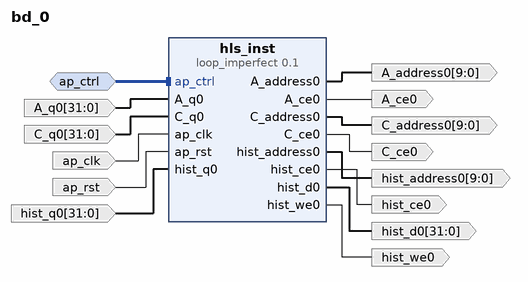
[diagram p0: block diagram of the top level]
# Vivado block design bd_0, xc7k160tfbg484-1, Vivado 2019.2
create_bd_design bd_0

create_bd_intf_port -mode Slave -vlnv xilinx.com:interface:acc_handshake_rtl:1.0 ap_ctrl
create_bd_port -dir O -from 9 -to 0 -type data A_address0
create_bd_port -dir O A_ce0
create_bd_port -dir I -from 31 -to 0 -type data A_q0
create_bd_port -dir O -from 9 -to 0 -type data C_address0
create_bd_port -dir O C_ce0
create_bd_port -dir I -from 31 -to 0 -type data C_q0
create_bd_port -dir I -type clk ap_clk
set_property -dict {CONFIG.FREQ_HZ 250000000.0} [get_bd_ports ap_clk]
create_bd_port -dir I -type rst ap_rst
set_property -dict {CONFIG.POLARITY ACTIVE_HIGH} [get_bd_ports ap_rst]
create_bd_port -dir O -from 9 -to 0 -type data hist_address0
create_bd_port -dir O hist_ce0
create_bd_port -dir O -from 31 -to 0 -type data hist_d0
create_bd_port -dir I -from 31 -to 0 -type data hist_q0
create_bd_port -dir O hist_we0

create_bd_cell -type ip -vlnv xilinx.com:hls:loop_imperfect:0.1 hls_inst

# ---- connections ----

connect_bd_intf_net -intf_net ap_ctrl_0_1 [get_bd_intf_ports ap_ctrl] [get_bd_intf_pins hls_inst/ap_ctrl]
connect_bd_net [get_bd_pins hls_inst/A_address0] [get_bd_ports A_address0]
connect_bd_net [get_bd_pins hls_inst/A_ce0] [get_bd_ports A_ce0]
connect_bd_net -net A_q0_0_1 [get_bd_ports A_q0] [get_bd_pins hls_inst/A_q0]
connect_bd_net [get_bd_pins hls_inst/C_address0] [get_bd_ports C_address0]
connect_bd_net [get_bd_pins hls_inst/C_ce0] [get_bd_ports C_ce0]
connect_bd_net -net C_q0_0_1 [get_bd_ports C_q0] [get_bd_pins hls_inst/C_q0]
connect_bd_net -net ap_clk_0_1 [get_bd_ports ap_clk] [get_bd_pins hls_inst/ap_clk]
connect_bd_net -net ap_rst_0_1 [get_bd_ports ap_rst] [get_bd_pins hls_inst/ap_rst]
connect_bd_net [get_bd_pins hls_inst/hist_address0] [get_bd_ports hist_address0]
connect_bd_net [get_bd_pins hls_inst/hist_ce0] [get_bd_ports hist_ce0]
connect_bd_net [get_bd_pins hls_inst/hist_d0] [get_bd_ports hist_d0]
connect_bd_net -net hist_q0_0_1 [get_bd_ports hist_q0] [get_bd_pins hls_inst/hist_q0]
connect_bd_net [get_bd_pins hls_inst/hist_we0] [get_bd_ports hist_we0]

validate_bd_design
save_bd_design
